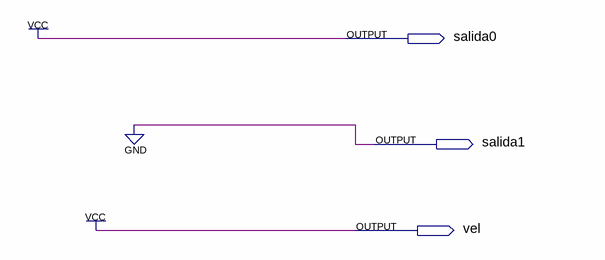
[diagram p0: schematic sheet]
// Quartus schematic pruebarueda.bdf as structural Verilog: 0 symbols, 3 pins
module pruebarueda (
  output salida0,
  output salida1,
  output vel
);


  assign salida0 = 1'b1;
  assign salida1 = 1'b0;
  assign vel = 1'b1;
endmodule
